# Altium schematic sheet TYPE-C 16PLC-H10.01_TYPE-C 16PLC-H10.0.schdoc.schdoc
size 124 x 99 mm
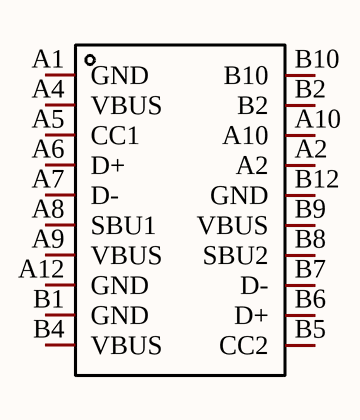
[diagram p0: TYPE-C 16PLC-H10.01_TYPE-C 16PLC-H10.0.schdoc.schdoc]

## Parts
U?  TYPE-C 16PLC-H10.0  [TYPE-C-TH_16PLC-H10.0]  (value not drawn)

## Nets

Not connected (* = marked no-connect by the designer): U? A1(GND) A2 A4(VBUS) A5(CC1) A6(D+) A7(D-) A8(SBU1) A9(VBUS) A10 A12(GND) B1(GND) B2 B4(VBUS) B5(CC2) B6(D+) B7(D-) B8(SBU2) B9(VBUS) B10 B12(GND)

## Library data of the parts
U? = TYPE-C 16PLC-H10.0: Manufacturer: SHOU HAN(首韩); Add into BOM: yes; Gender: 母; Number of Ports: 1; Number of Contacts: 16P; Current Rating - Power (Max): 5A; Symbol: TYPE-C 16PLC-H10.0; Device: TYPE-C 16PLC-H10.0; Supplier: LCSC; Supplier Part: C3151747; Manufacturer Part: TYPE-C 16PLC-H10.0; JLCPCB Part Class: Extended Part; LCSC Part Name: Type-C 母 直插; Supplier Footprint: 插件; Datasheet: https://atta.szlcsc.com/upload/public/pdf/source/20220627/08B499005F68E151B77B3CADC9182F41.pdf; Convert to PCB: yes; Connector Type: Type-C; Standard: -; Mounting Style: 直插; Contact Material: -; Contact Plating: -; Operating Temperature Range: -40℃~+85℃